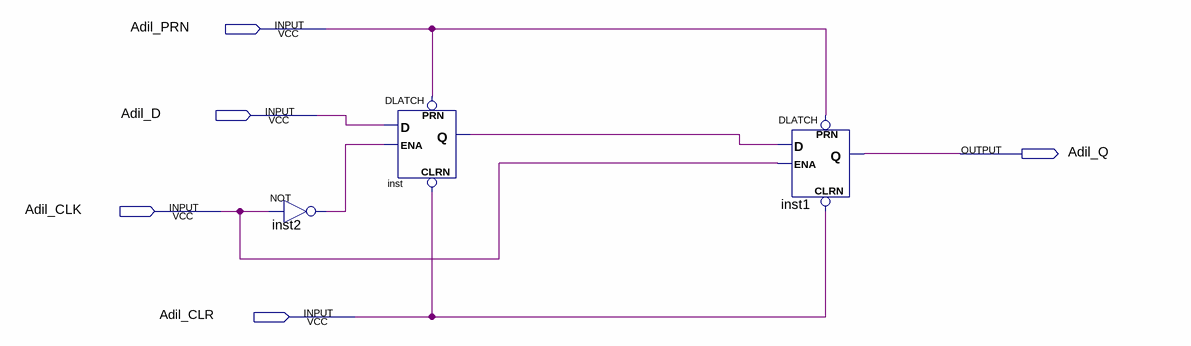
[diagram p0: schematic sheet]
// Quartus schematic Adil_MASTERSLAVE_DFLIPFLOP.bdf as structural Verilog: 3 symbols, 5 pins
module Adil_MASTERSLAVE_DFLIPFLOP (
  input  Adil_PRN,
  input  Adil_D,
  input  Adil_CLK,
  input  Adil_CLR,
  output Adil_Q
);

  wire inst2_out, inst_q;

  not inst2 (inst2_out, Adil_CLK);
  DLATCH inst (.CLRN(Adil_CLR), .D(Adil_D), .ENA(inst2_out), .PRN(Adil_PRN), .Q(inst_q));
  DLATCH inst1 (.CLRN(Adil_CLR), .D(inst_q), .ENA(Adil_CLK), .PRN(Adil_PRN), .Q(Adil_Q));
endmodule
